# Altium schematic sheet 0001.SchDoc
size 400 x 299 mm; SheetNumber: 1; SheetTotal: 1
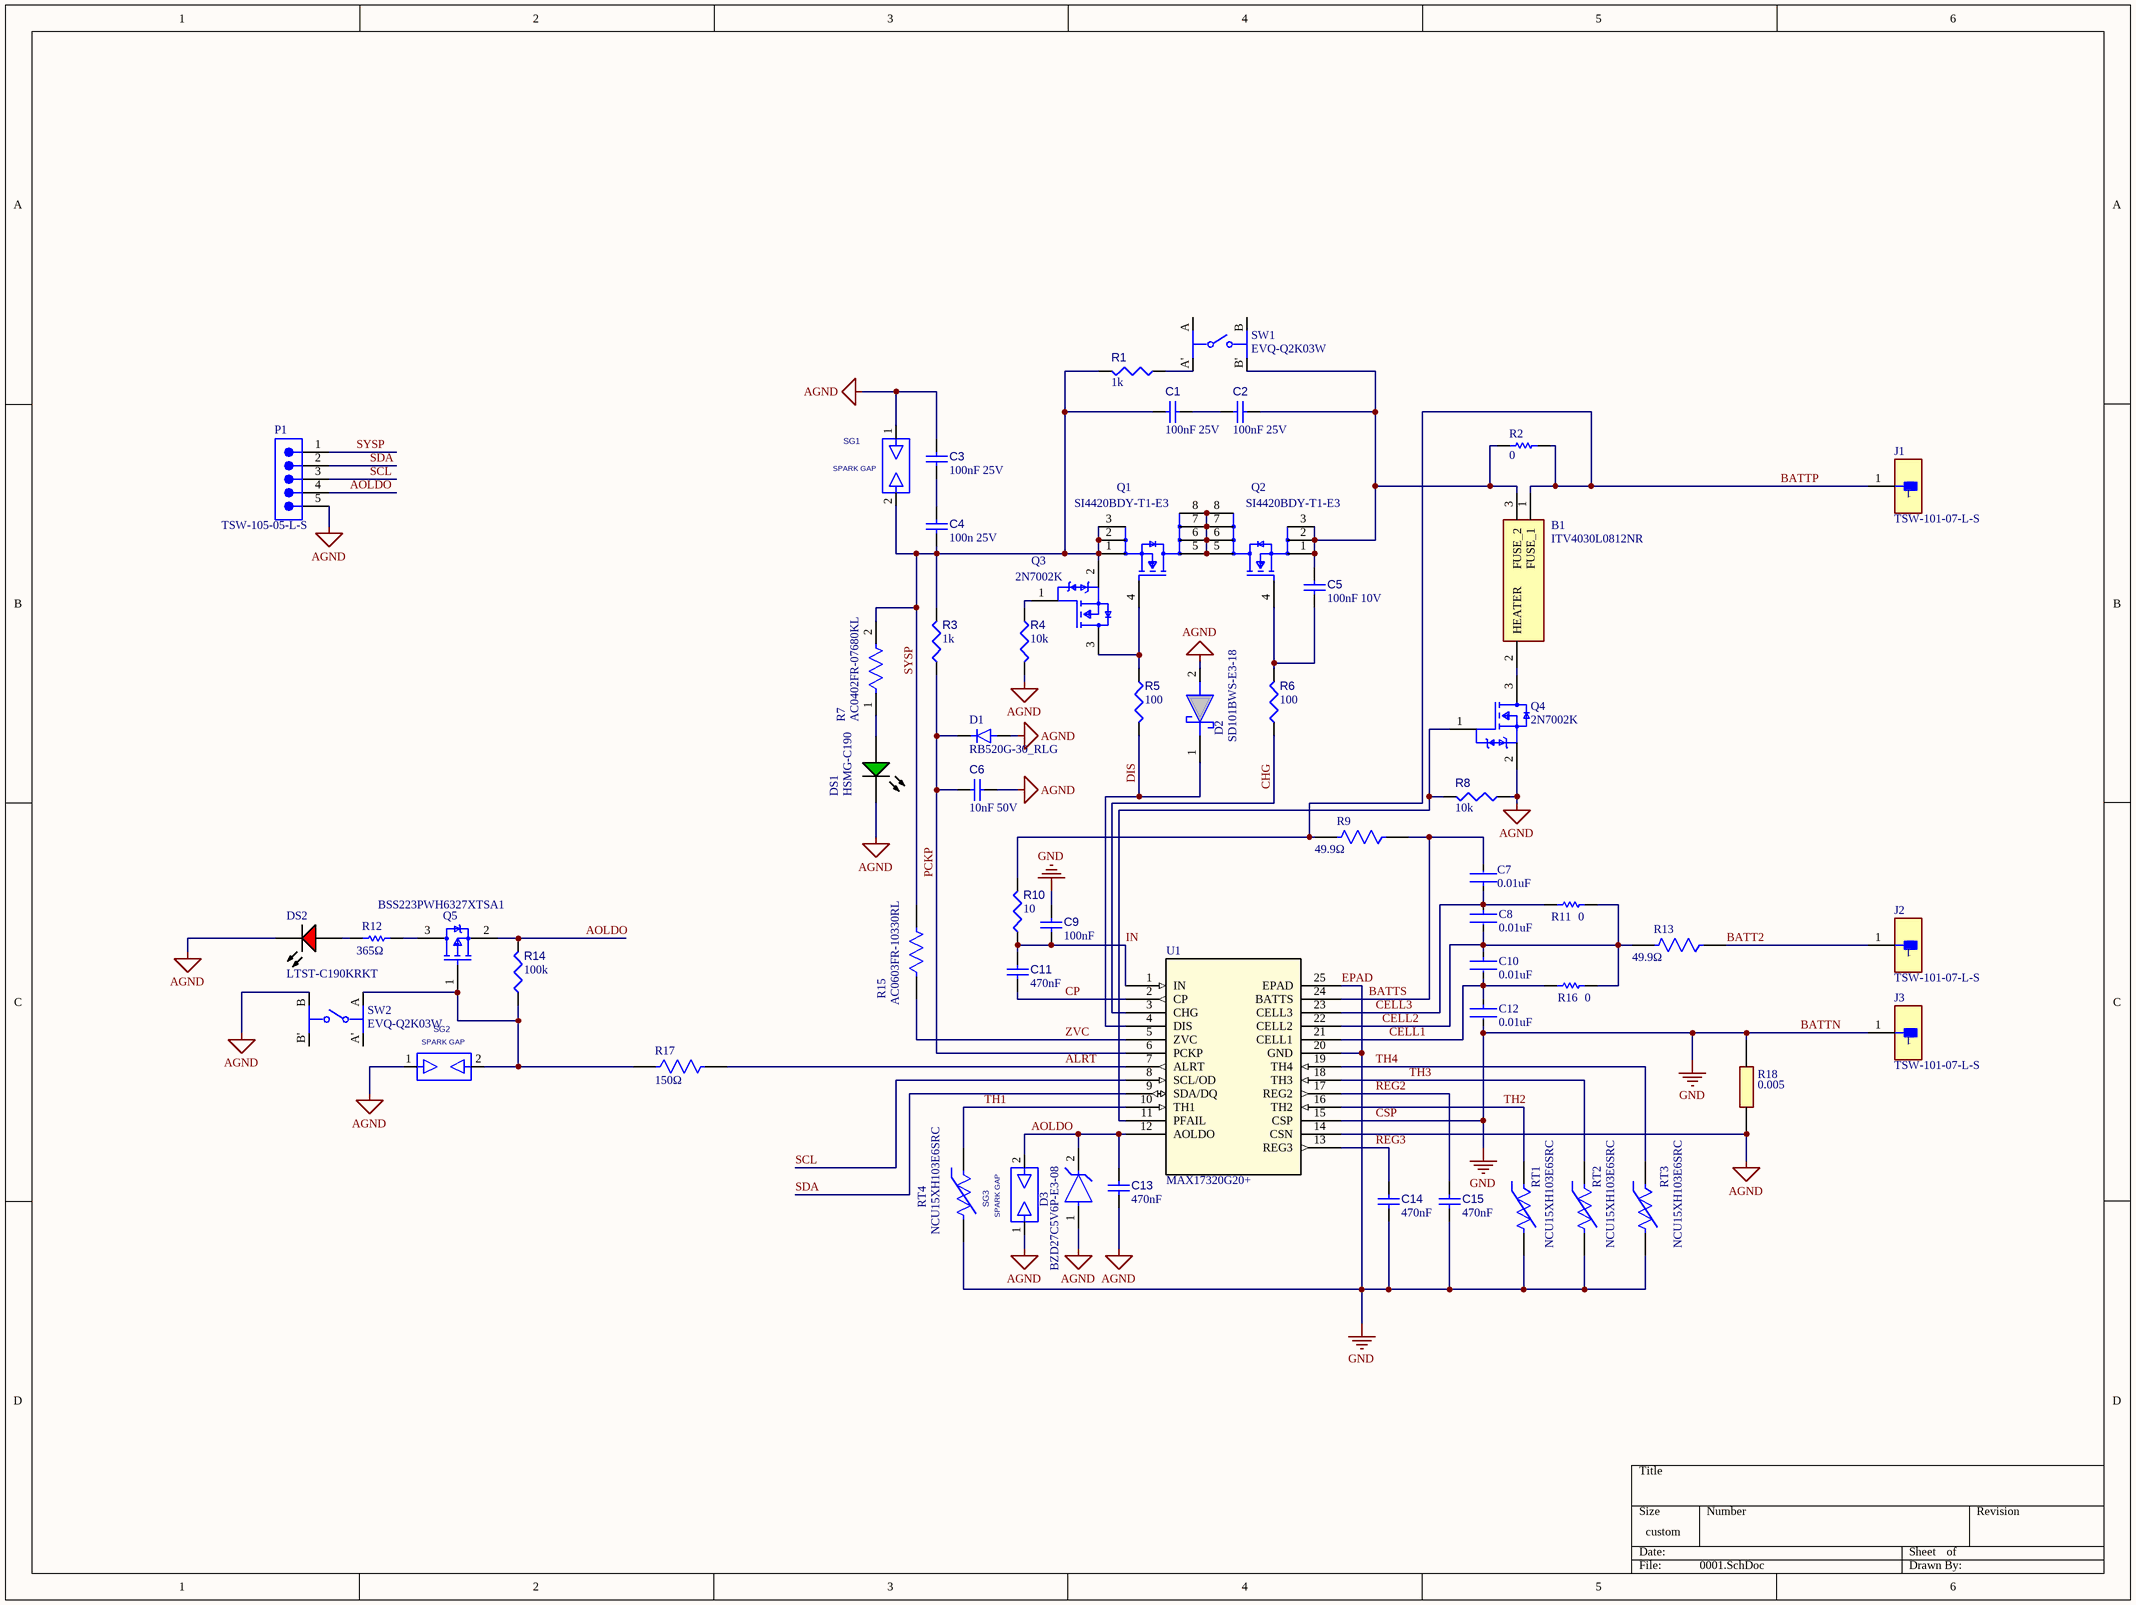
[diagram p0: 0001.SchDoc]

## Parts
B1  ITV4030L0812NR  [ITV4030L0812NR]
C1  value 100nF 25V  [CAPC0402(1005)60_L]  (hidden comment: Capacitor 100nF +/-20% 25V 0402)
C2  value 100nF 25V  [CAPC0402(1005)60_L]  (hidden comment: Capacitor 100nF +/-20% 25V 0402)
C3  value 100nF 25V  [CAPC0402(1005)60_L]  (hidden comment: Capacitor 100nF +/-20% 25V 0402)
C4  value 100n 25V  [CAPC0402(1005)60_L]  (hidden comment: Capacitor 100nF +/-20% 25V 0402)
C5  value 100nF 10V  [CAPC0402(1005)60_L]  (hidden comment: Capacitor 100nF +/-20% 10V 0402)
C6  value 10nF 50V  [CAPC0402(1005)60_L]  (hidden comment: Capacitor 10nF +/-20% 50V 0402)
C7  0.01uF  [FP-C1206C-EB-MFG]
C8  0.01uF  [FP-C1206C-EB-MFG]
C9  value 100nF  [CAPC0402(1005)60_L]  (hidden comment: Capacitor 100nF +/-20% 25V 0402)
C10  0.01uF  [FP-C1206C-EB-MFG]
C11  value 470nF  [CAPC0603(1608)100_L]  (hidden comment: Capacitor 470nF +/-20% 25V 0603)
C12  0.01uF  [FP-C1206C-EB-MFG]
C13  value 470nF  [CAPC0603(1608)100_L]  (hidden comment: Capacitor 470nF +/-20% 25V 0603)
C14  value 470nF  [CAPC0402(1005)60_L]  (hidden comment: Capacitor 470nF +/-40% 10V 0402)
C15  value 470nF  [CAPC0402(1005)60_L]  (hidden comment: Capacitor 470nF +/-40% 10V 0402)
D1  RB520G-30_RLG  [DIO_RB520G-30_RLG]
D2  SD101BWS-E3-18  [SOD2713X115N]
D3  BZD27C5V6P-E3-08  [FP-S8-V-3915_01-001-MFG]
DS1  HSMG-C190  [AVAG-HSMX-C190_V]
DS2  LTST-C190KRKT  [LTST-C191KRKT_V]
J1  TSW-101-07-L-S  [FP-TSW-101-07-L-S-MFG]
J2  TSW-101-07-L-S  [FP-TSW-101-07-L-S-MFG]
J3  TSW-101-07-L-S  [FP-TSW-101-07-L-S-MFG]
P1  TSW-105-05-L-S  [SMTC-TSW-105-05-X-S]
Q1  SI4420BDY-T1-E3  [FP-C-06527-MFG]
Q2  SI4420BDY-T1-E3  [FP-C-06527-MFG]
Q3  2N7002K  [FP-318-08-MFG]
Q4  2N7002K  [FP-318-08-MFG]
Q5  BSS223PWH6327XTSA1  [FP-PG-SOT323-3-MFG]
R1  value 1k  [RESC0402(1005)_L]  (hidden comment: Resistor 1K +/-5 % 0402 63 mW)
R2  value 0  [RESC2013X60X35ML10T20]  (hidden comment: Resistor 0R +/- 5% 0805 125 mW)
R3  value 1k  [RESC0402(1005)_L]  (hidden comment: Resistor 1K +/-5 % 0402 63 mW)
R4  value 10k  [RESC0402(1005)_L]  (hidden comment: Resistor 10K  +/-1 % 0402 63 mW)
R5  value 100  [RESC0402(1005)_L]  (hidden comment: Resistor 100R +/-1 % 0402 63 mW)
R6  value 100  [RESC0402(1005)_L]  (hidden comment: Resistor 100R +/-1 % 0402 63 mW)
R7  AC0402FR-07680KL  [FP-AC0402-IPC_C]
R8  value 10k  [RESC0402(1005)_L]  (hidden comment: Resistor 10K  +/-1 % 0402 63 mW)
R9  49.9Ω  [FP-RMCF0805-IPC_C]
R10  value 10  [RESC0402(1005)_L]  (hidden comment: Resistor 10R  +/-1 % 0402 63 mW)
R11  value 0  [RESC1005X40X25ML05T10]  (hidden comment: Resistor 0R 0402 63 mW)
R12  365Ω  [RESC1005X40X25NL05T10]
R13  49.9Ω  [FP-RMCF0805-IPC_C]
R14  value 100k  [RESC0402(1005)_L]  (hidden comment: Resistor 100K +/-1 % 0402 63 mW)
R15  AC0603FR-10330RL  [FP-AC0603-IPC_A]
R16  value 0  [RESC1005X40X25ML05T10]  (hidden comment: Resistor 0R 0402 63 mW)
R17  150Ω  [FP-AF0402-IPC_B]
R18  0.005  [RESC1608X80N]
RT1  NCU15XH103E6SRC  [FP-NCP15-NCU15-0_05-IPC_A]
RT2  NCU15XH103E6SRC  [FP-NCP15-NCU15-0_05-IPC_A]
RT3  NCU15XH103E6SRC  [FP-NCP15-NCU15-0_05-IPC_A]
RT4  NCU15XH103E6SRC  [FP-NCP15-NCU15-0_05-IPC_A]
SG1  SPARK GAP  [EVKIT_SPARK_GAP]
SG2  SPARK GAP  [EVKIT_SPARK_GAP]
SG3  SPARK GAP  [EVKIT_SPARK_GAP]
SW1  EVQ-Q2K03W  [FP-EVQ-Q2K03W-MFG]
SW2  EVQ-Q2K03W  [FP-EVQ-Q2K03W-MFG]
U1  MAX17320G20+  [21-0139I_T2444-4_MXM]

## Nets
AGND: C3.1 C6.1 C13.2 D1.A D2.2(A) D3.1(A) DS1.2(K) DS2.2(K) P1.5 Q4.2(Source) R4.1 R8.1 R18.1 SG1.1 SG2.1 SG3.1 SW2.B U1.14(CSN)
BATTN: C9.2 C12.2 C14.2 C15.2 J3.1 R18.2 RT1.2 RT2.2 RT3.2 RT4.2 U1.15(CSP) U1.20(GND) U1.25(EPAD)  [also labelled CSP, EPAD, GND]
ALRT: R17.2 U1.7(ALRT)
AOLDO: C13.1 D3.2(C) P1.4 Q5.2(Source) R14.2 SG3.2 U1.12(AOLDO)
BATT2: J2.1 R13.1
BATTP: B1.1(FUSE_1) J1.1 R2.2 R9.2 R10.2
BATTS: C7.2 R9.1 U1.24(BATTS)
CELL1: C10.2 C12.1 R16.1 U1.21(CELL1)
CELL2: C8.2 C10.1 R11.2 R13.2 R16.2 U1.22(CELL2)
CELL3: C7.1 C8.1 R11.1 U1.23(CELL3)
CHG: R6.2 U1.3(CHG)
CP: C11.2 U1.2(CP)
DIS: D2.1(K) R5.1 U1.4(DIS)
IN: C9.1 C11.1 R10.1 U1.1(IN)
PCKP: C6.2 D1.C(K) R3.2 U1.6(PCKP)
REG2: C15.1 U1.17(REG2)
REG3: C14.1 U1.13(REG3)
SCL: P1.3 U1.8(SCL/OD)
SDA: P1.2 U1.9(SDA/DQ)
SYSP: C1.1 C4.2 P1.1 Q1.1(S) Q1.2(S) Q1.3(S) Q3.2(Source) R1.2 R3.1 R7.2 R15.2 SG1.2
TH1: RT4.1 U1.10(TH1)
TH2: RT1.1 U1.16(TH2)
TH3: RT2.1 U1.18(TH3)
TH4: RT3.1 U1.19(TH4)
ZVC: R15.1 U1.5(ZVC)
NetB1_2: B1.2(HEATER) Q4.3(Drain)
NetB1_3: B1.3(FUSE_2) C2.2 C5.2 Q2.1(S) Q2.2(S) Q2.3(S) R2.1 SW1.B'
NetC1_2: C1.2 C2.1
NetC3_2: C3.2 C4.1
NetC5_1: C5.1 Q2.4(G) R6.1
NetDS1_1: DS1.1(A) R7.1
NetDS2_1: DS2.1(A) R12.1
NetQ1_4: Q1.4(G) Q3.3(Drain) R5.2
NetQ1_5: Q1.5(D) Q1.6(D) Q1.7(D) Q1.8(D) Q2.5(D) Q2.6(D) Q2.7(D) Q2.8(D)
NetQ3_1: Q3.1(Gate) R4.2
NetQ4_1: Q4.1(Gate) R8.2 U1.11(PFAIL)
NetQ5_1: Q5.1(Gate) R14.1 R17.1 SG2.2 SW2.A
NetQ5_3: Q5.3(Drain) R12.2
NetR1_1: R1.1 SW1.A'

Not connected (* = marked no-connect by the designer): SW1 A B; SW2 A' B'

## Library data of the parts
B1 = CMP-024-000000-1: Battery Management ITV 4.0*3.0MM 8V 12A; Manufacturer_Name: LITTELFUSE; Geometry.Height: 0.9mm; Mouser Part Number: 650-ITV4030L0812NR; Arrow Price/Stock: https://www.arrow.com/en/products/itv4030l0812nr/littelfuse?utm_currency=USD&region=nac; Datasheet Link: https://www.digikey.ph/en/products/detail/littelfuse-inc/ITV4030L0812NR/11618324?msockid=39f1ec84d77b6f4428b7f904d6676eed; Design Item ID: ITV4030L0812NR; Mouser Price/Stock: https://www.mouser.co.uk/ProductDetail/Littelfuse/ITV4030L0812NR?qs=vHuUswq2%252Bsyi6DFHI7u4jA%3D%3D; Source: ITV4030L0812NR.SchLib; Manufacturer_Part_Number: ITV4030L0812NR; Arrow Part Number: ITV4030L0812NR
C1-C4 C9 = CMP-001-00065-4: Chip Capacitor, 100nF +/-20%, 25V, 0402, Thickness 0.6 mm; Tolerance: 10%; Max Operating Temperature: 85°C; Min Operating Temperature: -55°C; Pins: 2; Voltage Rating: 25V; Mounting Technology: SMT; Case/Package: 0402
C5 = CMP-001-00061-3: Chip Capacitor, 100nF +/-20%, 10V, 0402, Thickness 0.6 mm; Tolerance: 20%; Mounting Technology: SMT; Voltage Rating: 10V; Max Operating Temperature: 85°C; Pins: 2; Case/Package: 0402; Min Operating Temperature: -55°C
C6 = CMP-001-00069-3: Chip Capacitor, 10nF +/-20%, 50V, 0402, Thickness 0.6 mm; Tolerance: 5%; Max Operating Temperature: 85°C; Pins: 2; Case/Package: 0402; Voltage Rating: 50V; Min Operating Temperature: -55°C; Mounting Technology: SMT
C7 C8 C10 C12 = CMP-03020-029284-1: C1206 10,000 pF X8R 20.00% 10 V; Manufacturer: KEMET; Manufacturer Part Number: C1206C103M8HACTU; Automotive Grade: Grade 0; Temperature Coefficient: 15%; Tolerance: 0.2; Material: Ceramic; Voltage Rating: 10 V; Category: Cap; Package: C1206C-EB; Automotive: Yes; Temperature Range High: +150°C; RoHS: TRUE; Capacitance: 10,000 pF; Temperature: -55°C to +150°C; Temperature Characteristic: X8R; ComponentLink2Description: Datasheet; Value: 10,000 pF; Octopart: https://octopart.com/c1206c103m8hactu-kemet-88727734; ComponentLink2URL: https://content.kemet.com/datasheets/KEM_C1007_X8R_ULTRA_150C_SMD.pdf; Device Class L2: Capacitors; Temperature Range Low: -55°C; Lead Free: Yes; Device Class L3: Ceramic Capacitors; Ipc Land Pattern Name: CAPC320160X78; Height: 0.88mm; Device Class L1: Passive Components
C11 C13 = CMP-001-00077-3: Chip Capacitor, 470nF +/-20%, 25V, 0603, Thickness 1 mm; Tolerance: 10%; Max Operating Temperature: 85°C; Voltage Rating: 25V; Pins: 2; Case/Package: 0603; Mounting Technology: SMT; Min Operating Temperature: -55°C
C14 C15 = CMP-001-00060-4: Chip Capacitor, 470nF +/-40%, 10V, 0402, Thickness 0.6 mm; Tolerance: 20%; Max Operating Temperature: 85°C; Case/Package: 0402; Voltage Rating: 10V; Min Operating Temperature: -55°C; Mounting Technology: SMT; Pins: 2
D1 = CMP-021-000000-1: SOD-723F, 30V, 0.1A, Schottky Diode; MF: Taiwan Semiconductor; MP: RB520G-30 RLG; Value: *; Pin Count: 2; SnapEDA_Link: https://www.snapeda.com/parts/RB520G-30%20RLG/Taiwan+Semiconductor/view-part/?ref=snap; Design Item ID: RB520G-30_RLG; Check_prices: https://www.snapeda.com/parts/RB520G-30%20RLG/Taiwan+Semiconductor/view-part/?ref=eda; Component Type: Standard; Source: RB520G-30_RLG.SchLib; Package: SOD-723F Taiwan Semiconductor
D2 = CMP-019-000000-1: Schottky Diodes & Rectifiers 30mA 50Volt 2A IFSM; Manufacturer_Name: Vishay; Geometry.Height: 1.15mm; Design Item ID: SD101BWS-E3-18; Mouser Part Number: 78-SD101BWS-E3-18; Mouser Price/Stock: https://www.mouser.co.uk/ProductDetail/Vishay-Semiconductors/SD101BWS-E3-18?qs=S660mHfF5o09vR8sqS5amQ%3D%3D; Manufacturer_Part_Number: SD101BWS-E3-18; Datasheet Link: http://www.vishay.com/docs/85680/sd101aws.pdf; Source: SD101BWS-E3-18.SchLib
D3 = CMP-02541-000005-1: DIODE ZENER 5.6V 800MW DO219AB; Manufacturer: Vishay; Max Reverse Leakage Current: 10uA; Max Junction Temp: +175°C; Zener Impedance: 2Ω; Reverse Voltage: 2V; Forward Current: 0.2A; Max Zener Voltage: 6V; Standoff Height: 0mm; Automotive Grade: NA; Digikey Description: DIODE ZENER 5.6V 800MW DO219AB; Package: S8-V-3915.01-001; RoHS: TRUE; Octopart: https://octopart.com/bzd27c5v6p-e3-08-vishay-30317385; Nom Zener Voltage: 5.6V; Temperature Range Low: -65°C; ComponentLink2Description: Datasheet; ComponentLink2URL: http://www.vishay.com/docs/85153/bzd27series.pdf; Lead Free: Yes; Power Dissipation: 800mW; Manufacturer Part Number: BZD27C5V6P-E3-08; Category: Diode; Height: 1.08mm; Mouser Description: Diode Zener Single 5.6V 800mW 2-Pin DO-219AB T/R; Temperature: -65°C to +175°C; Device Class L2: Diodes; Device Class L3: Zener Diodes; Temperature Range High: +175°C; Automotive: No; Device Class L1: Discrete Semiconductors
DS1 = CMP-007-00013-2: LED Uni-Color Green, 52 mW, 20 mA, -40 to 85 degC, 2-Pin SMD, RoHS, Tape and Reel; Manufacturer: Avago; Forward Current: 20mA; Viewing Angle: 170degrees; Luminous Intensity: 15mcd; Lens Style: Diffused; Forward Voltage: 2.2V; Power: 52mW; Mounting Technology: SM; RoHS Compliant: True; Packaging: TapeandReel; Illumination Colour: Green; Datasheet URL: http://docs.avagotech.com/docs/AV02-0551EN; Min Operating Temperature: -40°C; Max Operating Temperature: 85°C; Pins: 2; Package Description: 2-Pin Surface Mount Device, Body 1.6 x 0.8 mm, Height 0.9 mm; Nominal Vf: 2.2V; Case/Package: 0603; Manufacturer URL: http://www.avagotech.com/; Datasheet Version: Mar-12; Colour: Green; Package Reference: HSMX-C190; Package Quantity: 4000
DS2 = CMP-007-00024-2: LED Uni-Color Red, 62.5 mW, 25 mA, -30 to 85 degC, 2-Pin SMD, RoHS, Tape and Reel; Manufacturer: Lite-On; Power: 75mW; Forward Voltage: 2V; Luminous Intensity: 54mcd; Lens Style: Diffused; Viewing Angle: 130degrees; Forward Current: 20mA; Manufacturer URL: http://www.us.liteon.com/; Case/Package: 0603; Datasheet Version: Rev. F, 05/2013; Package Reference: C191KRKT; Datasheet URL: http://optoelectronics.liteon.com/upload/download/DS-22-99-0151/S_110_LTST-C190KRKT.pdf; Package Description: 2-Pin Surface Mount Device, Body 1.6 x 0.8 mm; Nominal Vf: 2V; Packaging: TapeandReel; RoHS Compliant: True; Pins: 2; Illumination Colour: Red; Colour: Red; Mounting Technology: SM; Package Quantity: 3000; Min Operating Temperature: -55°C; Max Operating Temperature: 85°C
J1-J3 = CMP-02766-001775-1: CONN HEADER VERT 1POS; Gender: Male; Number of Contacts: 1; Max Current Rating: 7.6A; Max Voltage Rating (AC): 550V; RoHS Compliant: Yes; Contact Finish - Mating: GOLD; Length: 2.54mm; Series: TSW; Insulation Material: PBT; Reach SVHC Compliant: Yes; Radiation Hardening: No; Contact Plating: Gold; Termination: Solder; Contact Type: Male Pin; Orientation: Straight; Number of Rows: 1; Depth: 2.54mm; Housing Material: Polyester; Lead Free: Lead Free; Fastening Type: Pull; Flammability Rating: UL94 V-0; Mount: Through Hole; Housing Color: Black; Contact Shape: Square; Min Operating Temperature: -55°C; Connector Type: Header; Contact Mating Length: 0.23inch; Width: 2.54mm; Packaging: Bulk; Contact Material: Bronze; Max Operating Temperature: 125°C; Number of Positions: 1; Color: Black; Insulation Color: Black
P1 = CMP-1024-00366-1: 0.025" SQ Post Header, Through-hole, Vertical, -55 to 125 degC, 2.54 mm Pitch, 5-Pin, Male, RoHS; Manufacturer: Samtec; Pitch: 2.54 mm; PackageVersion: DM, 8/1988; PartNumber: TSW-105-05-L-S; Orientation: Vertical; Temperature Range: -55 to 125 degC; ComponentLink1Description: Manufacturer URL; PackageDescription: .025[0.64] SQ. Post Terminal Strip Assembly; ComponentLink2URL: http://www.samtec.com/documents/webfiles/pdf/TSW_TH.PDF; PackageReference: TSW-105-05-X-S; ComponentLink2Description: Datasheet; Mounting Technology: Through-hole; DatasheetVersion: F-214; ComponentLink1URL: http://www.samtec.com; RoHS: True; ComponentLink3URL: http://www.samtec.com/documents/webfiles/cpdf/TSW-XXX-XX-XXX-X-XX-XXX-MKT.pdf; ComponentLink3Description: Package Specification
Q1 Q2 = CMP-00030-46514802-1: SI4420BDY-T1-E3 Si4420BDY Series 30 V 9.5 A 8.5 mOhm Surface Mount N-Channel Mosfet - SOIC-8; Number of Channels: 1; Turn-Off Delay Time: 40ns; Power Dissipation: 1.4W; Rds On Max: 8.5mΩ; Gate to Source Voltage (Vgs): 20V; Forward Voltage: 750mV; Max Junction Temperature (Tj): 150°C; Rise Time: 11ns; Turn-On Delay Time: 15ns; Fall Time: 12ns; Drain to Source Breakdown Voltage: 30V; Threshold Voltage: 3V; Drain to Source Resistance: 7mΩ; Element Configuration: Single; Continuous Drain Current (ID): 9.5A; Mount: Surface Mount; Length: 5mm; Weight: 186.993455mg; Number of Elements: 1; REACH SVHC: Unknown; Width: 4mm; RoHS: Compliant; Max Operating Temperature: 150°C; Case/Package: SOIC; Lead Free: Lead Free; Max Power Dissipation: 1.4W; Height: 1.55mm; Radiation Hardening: No; Min Operating Temperature: -55°C; Schedule B: 8541290080, 8541290080; NexarPartId: 46514802; Resistance: 8.5mΩ; Drain to Source Voltage (Vdss): 30V; Number of Pins: 8
Q3 Q4 = CMP-07173-000009-1: MOSFET N-CH 60V 300MA SOT23; Manufacturer: ON Semiconductor; Turn Off Delay Time: 55.8ns; Max Forward Diode Voltage: 1.2V; Max Junction Temp: +150°C; Pulse Drain Current: 5A; Threshold Vgs Min: 1V; Depletion Mode: False; Drain To Source Resistance: 1.19Ω; Number Of N Channels: 1; Standoff Height: 0.01mm; Rthja Max: 417°C/W; Input Capacitace At Vds: 24.5pF @ 20V; Threshold Vgs Max: 2.3V; Turn On Delay Time: 12.2ns; Gate Charge At Vgs: 0.7nC @ 4.5V; Continuous Drain Current: 320mA; Transconductance: 0.53S; Power Dissipation: 300mW; Gate To Source Voltage: 20V; Typ Forward Diode Voltage: 0.8V; ComponentLink2URL: https://www.onsemi.com/pub/Collateral/2N7002K-D.pdf; RoHS: TRUE; Device Class L1: Discrete Semiconductors; ComponentLink2Description: Datasheet; Manufacturer Part Number: 2N7002K; Octopart: https://octopart.com/2n7002k-on+semiconductor-84408900; Device Class L3: MOSFETs; Mouser Description: N-Channel 60 V 2 Ohm SMT Enhancement Mode Field Effect Transistor SOT-23; Ipc Land Pattern Name: SOT95P240X100-3; Temperature Range High: +150°C; Temperature Range Low: -55°C; Lead Free: Yes; Height: 1.11mm; Package: 318-08; Footprint Url: https://www.onsemi.com/pub/Collateral/318-08.PDF; Temperature: -55°C to +150°C; Drain To Source Voltage: 60V; Device Class L2: Transistors; Drain To Source Breakdown Voltage: 60V; Digikey Description: MOSFET N-CH 60V 300MA SOT23; Number Of Channels: 1; Category: Trans; Automotive: No
Q5 = CMP-32901-000184-1: MOSFET P-CH 20V 390MA SOT-323; Rds On Max: 1.2R; Max Power Dissipation: 250mW; Drain to Source Resistance: 2.1R; Turn-On Delay Time: 3.8ns; Threshold Voltage: -900mV; Element Configuration: Single; Turn-Off Delay Time: 5.1ns; Rise Time: 5ns; Gate to Source Voltage (Vgs): 12V; Drain to Source Voltage (Vdss): -20V; Input Capacitance: 56pF; Min Operating Temperature: -55°C; Mount: Surface Mount; Height: 0.8mm; Halogen Free: Halogen Free; REACH SVHC: No SVHC; Length: 2mm; Case/Package: SOT-323; Max Operating Temperature: 150°C; Packaging: Tape and Reel; Lead Free: Lead Free; Max Dual Supply Voltage: -20V; Continuous Drain Current (ID): 390mA; Number of Pins: 3; Width: 1.25mm
R1 R3 = CMP-009-00157-3: Chip Resistor, 1 kOhms, +/-5 %, 63 mW, -55 to 155 degC, 0402; Tolerance: 5%; Power: 63mW; Case/Package: 0402; Pins: 2; Min Operating Temperature: -55°C; Max Operating Temperature: 155°C
R2 = CMP-009-00007-5: Chip Resistor, 0 Ohm, 0.125 W, -55 to 155 degC, 0805 (2012 Metric); Power: 125mW; Voltage Rating: 50V; RoHS Compliant: True; Max Operating Temperature: 155°C; Case/Package: 0805; Mounting Technology: SM; Min Operating Temperature: -55°C; Tolerance: 5%; Pins: 2
R4 R8 = CMP-009-00149-3: Chip Resistor, 10 kOhms, +/-1 %, 63 mW, -55 to 125 degC, 0402; Power: 63mW; Tolerance: 1%; Min Operating Temperature: -55°C; Case/Package: 0402; Max Operating Temperature: 155°C; Pins: 2
R5 R6 = CMP-009-00167-3: Chip Resistor, 100 Ohms, +/-1 %, 63 mW, -55 to 155 degC, 0402; Power: 63mW; Tolerance: 1%; Min Operating Temperature: -55°C; Case/Package: 0402; Pins: 2; Max Operating Temperature: 155°C
R7 = CMP-03412-014052-2: RES 680kΩ ±1% 0.063W 0402; Max Power Dissipation: 63mW; Resistance: 680kR; Temperature Coefficient: 100ppm/°C; Military Standard: Not; Width: 0.02inch; Number of Terminations: 2; Length: 0.039inch; Features: Moisture Resistant; Resistor Type: Thick Film; Packaging: Tape and Reel; Max Operating Temperature: 155°C; Case/Package: 0402; Min Operating Temperature: -55°C; Series: AC; Depth: 0.5mm; Height: 0.015inch; Tolerance: 1%; RoHS Compliant: Yes
R9 R13 = CMP-26527-001980-1: 49.9Ω ±1% 0.125W 0805 Thick Film Chip Resistor AEC-Q200 compliant; Temperature Coefficient: 100ppm/°C; Max Power Dissipation: 125mW; Resistance: 49.9R; Resistor Type: Thick Film; Packaging: Tape and Reel; Features: Automotive AEC-Q200; RoHS Compliant: Yes; Series: RMCF; Min Operating Temperature: -55°C; Max Operating Temperature: 155°C; Length: 0.079inch; Number of Terminations: 2; Width: 0.049inch; Height: 0.026inch; Case/Package: 0805; Tolerance: 1%
R10 = CMP-009-00152-3: Chip Resistor, 10 Ohms, +/-1 %, 63 mW, -55 to 155 degC, 0402; Tolerance: 1%; Power: 63mW; Pins: 2; Max Operating Temperature: 155°C; Min Operating Temperature: -55°C; Case/Package: 0402
R11 R16 = CMP-009-00004-5: Chip Resistor, 0 Ohm, 0.063 W, -55 to 155 degC, 0402 (1005 Metric); Power: 63mW; Voltage Rating: 50V; Max Operating Temperature: 155°C; Pins: 2; RoHS Compliant: True; Min Operating Temperature: -55°C; Mounting Technology: SM; Case/Package: 0402
R12 = CMP-2002-07632-1: Manufacturer: Yageo; Part Number: RC0402FR-07365RL
R14 = CMP-009-00168-3: Chip Resistor, 100 kOhms, +/-1 %, 63 mW, -55 to 155 degC, 0402; Tolerance: 1%; Power: 63mW; Max Operating Temperature: 155°C; Min Operating Temperature: -55°C; Pins: 2; Case/Package: 0402
R15 = CMP-03412-032342-2: RES 330Ω 1.00% 0.1W 0603; RoHS Compliant: Yes
R17 = CMP-03412-049320-1: Anti-Sulfurated Chip Resistors Automotive Grade 150Ω 5% 100ppm/°C 0402; Max Power Dissipation: 63mW; Resistance: 150R; Number of Terminations: 2; Features: Moisture Resistant; RoHS Compliant: Yes; Length: 0.039inch; Resistor Type: Thick Film; Height: 0.015inch; Max Operating Temperature: 155°C; Temperature Coefficient: 100ppm/°C; Width: 0.02inch; Min Operating Temperature: -55°C; Series: AF; Case/Package: 0402; Packaging: Tape and Reel; Tolerance: 5%
R18 = CMP-013-000000-1: TT ELECTRONICS / WELWYN - MFC0603-R005FT5 - CURRENT SENSE RES, 0R005, 1%, 500 MW; Geometry.Height: 0.8mm; Mouser Part Number: 756-MFC0603-R005FT5; Manufacturer_Part_Number: MFC0603-R005FT5; Source: MFC0603-R005FT5.SchLib; Datasheet Link: https://componentsearchengine.com/Datasheets/1/MFC0603-R005FT5.pdf; Design Item ID: MFC0603-R005FT5; Mouser Price/Stock: https://www.mouser.com/Search/Refine.aspx?Keyword=756-MFC0603-R005FT5; Manufacturer_Name: TT Electronics
RT1-RT4 = CMP-06022-000214-2: NTC Thermistor for Temperature Sensor, Automotive, 0402, 10kΩ, 3%, 0.1mA, 5V; RoHS Compliant: Yes
SG1-SG3 = EK_SPARKGAP: EVKIT SPARK GAP; OriginalSymbolOrigin: (-100,50); PACK_TYPE: SMD; DRAWING: @MAX17320G_SOLDERDOWN_EVKIT_REVB.MAX17320G_SOLDERDOWN_EVKIT_REVB(SCH_1):PAGE2; PHYS_PAGE: 1; MAXINV: N/A; PCB Footprint_: EVKIT_SPARK_GAP; MFG_PART_NUMBER: SPARK GAP; TOLERANCE: N/A; VER: 1; VOLTAGE_RATING: N/A; MANUFACTURER: N/A; TEMP_RANGE: N/A
SW1 SW2 = CMP-05618-000015-1: SWITCH TACTILE SPST-NO 0.02A 15V; Manufacturer: Panasonic Electronic Components; Contact Resistance: 100mΩ; Electromechanical Life: 1000000Cycles; Contact Current Rating: 20mA; Operating Force: 1.3N; Mount: Surface Mount; Mouser Description: Tactile Switches 1.3NF 6.5x6.0x3.1mm; Device Class L2: Switches; RoHS: TRUE; Lead Free: Yes; Temperature Range Low: -40°C; Height: 3.3mm; Automotive: No; Device Class L3: Tactile Switches; Manufacturer Part Number: EVQ-Q2K03W; ComponentLink2URL: https://industrial.panasonic.com/cdbs/www-data/pdf/ATK0000/ATK0000C360.pdf; Throw Configuration: SPST-NO; Temperature: -40°C to +85°C; ComponentLink2Description: Datasheet; Device Class L1: Electromechanical; Voltage Rating Dc: 15V; Package: 0; Temperature Range High: +85°C; Octopart: https://octopart.com/evq-q2k03w-panasonic-1224370; Category: Switch; Digikey Description: SWITCH TACTILE SPST-NO 0.02A 15V
U1 = CMP-007-000000-1: 2S-4S ModelGauge m5 EZ Fuel Gauge with Protector, Internal Self-Discharge Detection, and SHA-256 Authentication; Manufacturer_Name: Analog Devices Inc; Type: Type; Copyright: Copyright (C) 2025 Ultra Librarian. All rights reserved.; Design Item ID: MAX17320G20+; Manufacturer_Part_Number: MAX17320G20+; RefDes: RefDes; Source: MAX17320G20&plus_.SchLib